# Altium schematic sheet Module01.SchDoc
size A
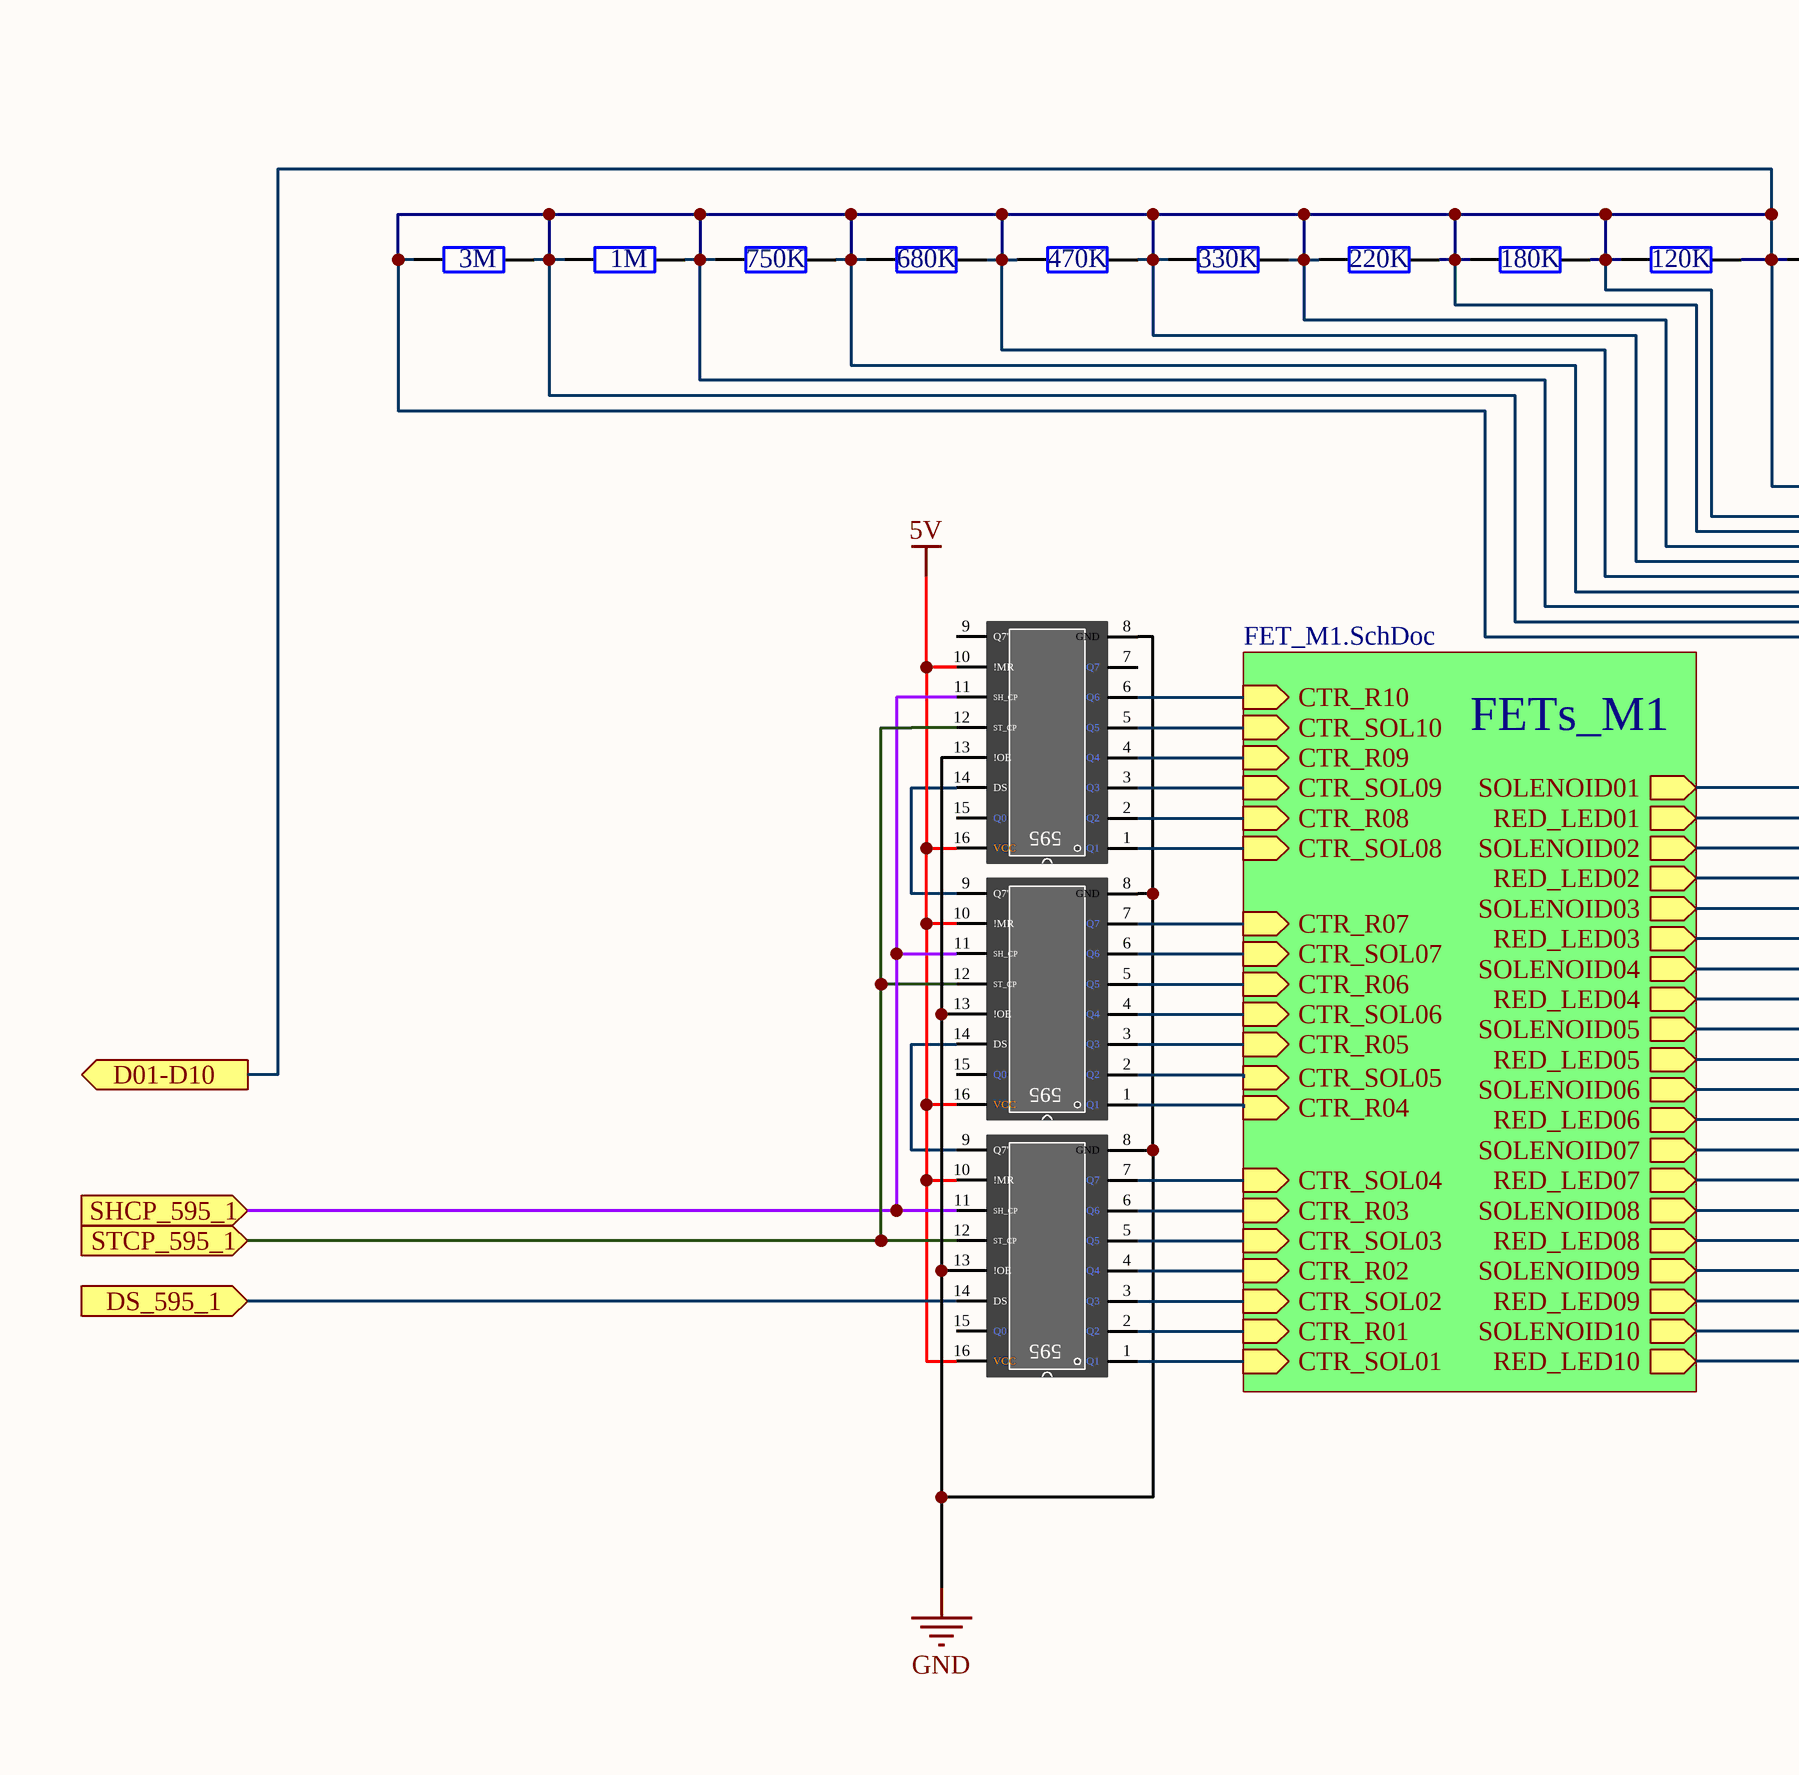
[diagram p0: Module01.SchDoc, left]
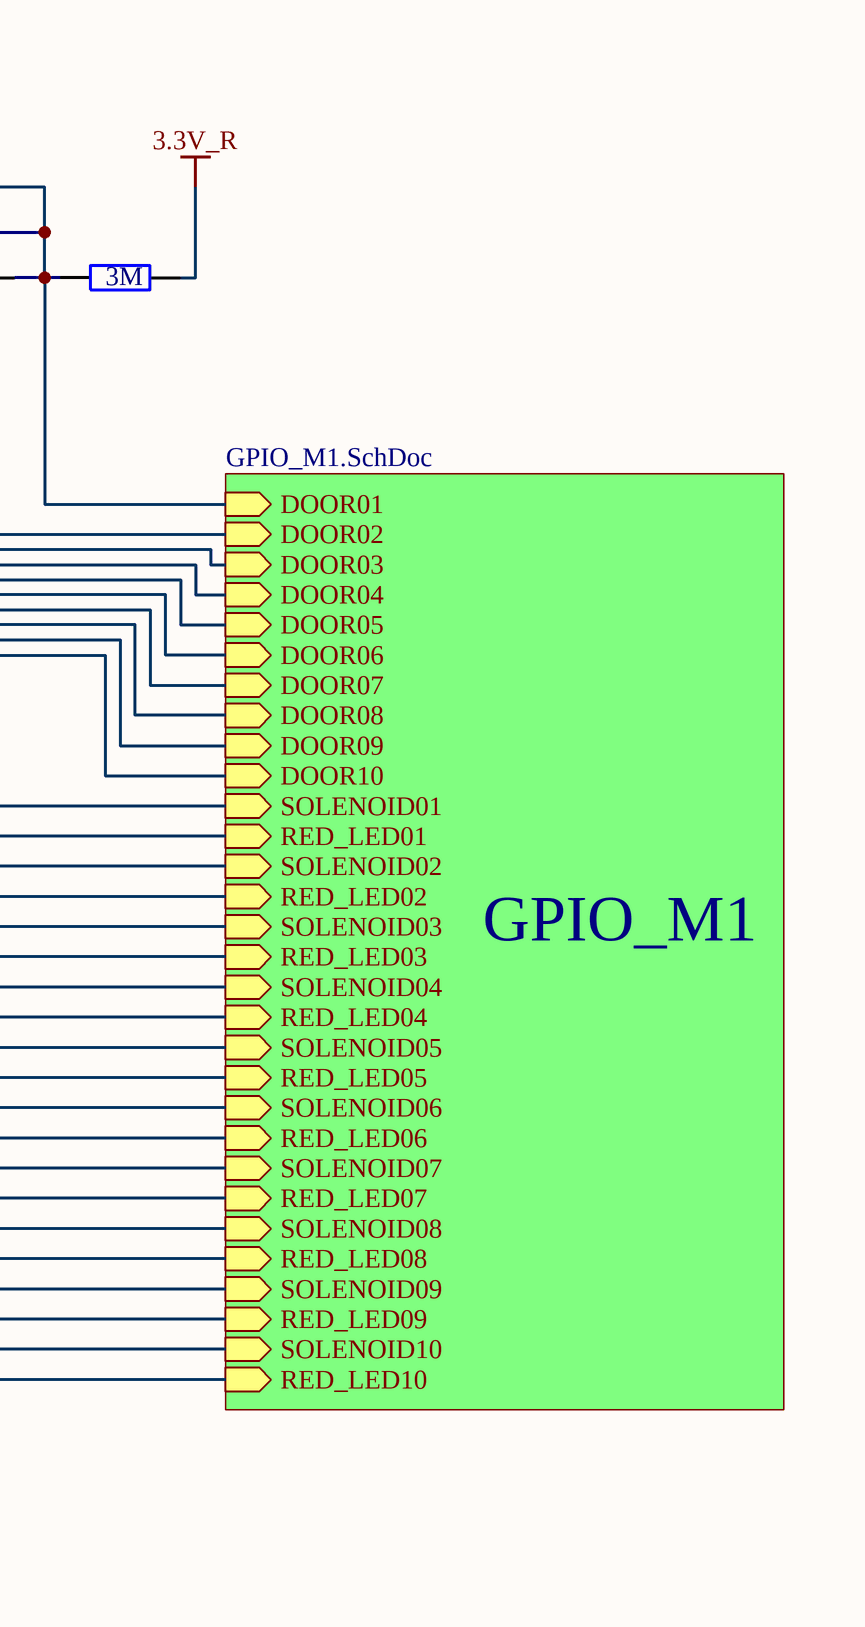
[diagram p1: Module01.SchDoc, right]

## Parts
1  5#HC74595  [5#HC74595]  (value not drawn)
2  5#HC74595  [5#HC74595]  (value not drawn)
3  5#HC74595  [5#HC74595]  (value not drawn)
R1  3M  [AXIAL-0.4]
R2  1M  [AXIAL-0.4]
R3  750K  [AXIAL-0.4]
R4  680K  [AXIAL-0.4]
R5  470K  [AXIAL-0.4]
R6  330K  [AXIAL-0.4]
R7  220K  [AXIAL-0.4]
R8  180K  [AXIAL-0.4]
R9  120K  [AXIAL-0.4]
R10  3M  [AXIAL-0.4]

## Sub-sheets
FETs_M1 = FET_M1.SchDoc: CTR_SOL01 (in), CTR_R01 (in), SOLENOID01 (out), RED_LED01 (out), CTR_SOL04 (in), CTR_R04 (in), SOLENOID04 (out), RED_LED04 (out), CTR_SOL07 (in), CTR_R07 (in), SOLENOID07 (out), RED_LED07 (out), CTR_SOL09 (in), CTR_R09 (in), SOLENOID09 (out), RED_LED09 (out), CTR_SOL02 (in), CTR_R02 (in), SOLENOID02 (out), RED_LED02 (out), CTR_SOL05 (in), CTR_R05 (in), SOLENOID05 (out), RED_LED05 (out), CTR_SOL08 (in), CTR_R08 (in), SOLENOID08 (out), RED_LED08 (out), CTR_SOL10 (in), CTR_R10 (in), SOLENOID10 (out), RED_LED10 (out), CTR_SOL03 (in), CTR_R03 (in), SOLENOID03 (out), RED_LED03 (out), CTR_SOL06 (in), CTR_R06 (in), SOLENOID06 (out), RED_LED06 (out)
GPIO_M1 = GPIO_M1.SchDoc: DOOR01 (in), DOOR02 (in), DOOR03 (in), DOOR04 (in), DOOR05 (in), SOLENOID01 (in), RED_LED01 (in), SOLENOID02 (in), RED_LED02 (in), SOLENOID03 (in), RED_LED03 (in), SOLENOID04 (in), RED_LED04 (in), SOLENOID05 (in), RED_LED05 (in), DOOR06 (in), DOOR07 (in), DOOR08 (in), DOOR09 (in), DOOR10 (in), SOLENOID06 (in), RED_LED06 (in), SOLENOID07 (in), RED_LED07 (in), SOLENOID08 (in), RED_LED08 (in), SOLENOID09 (in), RED_LED09 (in), SOLENOID10 (in), RED_LED10 (in)

## Ports
D01-D10 (out), DS_595_1 (in), SHCP_595_1 (in), STCP_595_1 (in)

## Nets
3.3V_R: R10.1
5V: 1.10(!MR) 1.16(VCC) 2.10(!MR) 2.16(VCC) 3.10(!MR) 3.16(VCC)
GND: 1.8(GND) 1.13(!OE) 2.8(GND) 2.13(!OE) 3.8(GND) 3.13(!OE)
D01-D10: R1.1 R1.2 R2.1 R2.2 R3.1 R3.2 R4.1 R4.2 R5.1 R5.2 R6.1 R6.2 R7.1 R7.2 R8.1 R8.2 R9.1 R9.2 R10.2 ; port D01-D10, sheet GPIO_M1/DOOR01, sheet GPIO_M1/DOOR02, sheet GPIO_M1/DOOR03, sheet GPIO_M1/DOOR04, sheet GPIO_M1/DOOR05, sheet GPIO_M1/DOOR06, sheet GPIO_M1/DOOR07, sheet GPIO_M1/DOOR08, sheet GPIO_M1/DOOR09, sheet GPIO_M1/DOOR10
DS_595_1: 1.14(DS) ; port DS_595_1
SHCP_595_1: 1.11(SH_CP) 2.11(SH_CP) 3.11(SH_CP) ; port SHCP_595_1
STCP_595_1: 1.12(ST_CP) 2.12(ST_CP) 3.12(ST_CP) ; port STCP_595_1
Net1_1: 1.1(Q1) ; sheet FETs_M1/CTR_SOL01
Net1_2: 1.2(Q2) ; sheet FETs_M1/CTR_R01
Net1_3: 1.3(Q3) ; sheet FETs_M1/CTR_SOL02
Net1_4: 1.4(Q4) ; sheet FETs_M1/CTR_R02
Net1_5: 1.5(Q5) ; sheet FETs_M1/CTR_SOL03
Net1_6: 1.6(Q6) ; sheet FETs_M1/CTR_R03
Net1_7: 1.7(Q7) ; sheet FETs_M1/CTR_SOL04
Net1_9: 1.9(Q7') 2.14(DS)
Net2_1: 2.1(Q1) ; sheet FETs_M1/CTR_R04
Net2_2: 2.2(Q2) ; sheet FETs_M1/CTR_SOL05
Net2_3: 2.3(Q3) ; sheet FETs_M1/CTR_R05
Net2_4: 2.4(Q4) ; sheet FETs_M1/CTR_SOL06
Net2_5: 2.5(Q5) ; sheet FETs_M1/CTR_R06
Net2_6: 2.6(Q6) ; sheet FETs_M1/CTR_SOL07
Net2_7: 2.7(Q7) ; sheet FETs_M1/CTR_R07
Net2_9: 2.9(Q7') 3.14(DS)
Net3_1: 3.1(Q1) ; sheet FETs_M1/CTR_SOL08
Net3_2: 3.2(Q2) ; sheet FETs_M1/CTR_R08
Net3_3: 3.3(Q3) ; sheet FETs_M1/CTR_SOL09
Net3_4: 3.4(Q4) ; sheet FETs_M1/CTR_R09
Net3_5: 3.5(Q5) ; sheet FETs_M1/CTR_SOL10
Net3_6: 3.6(Q6) ; sheet FETs_M1/CTR_R10
(unnamed): sheet FETs_M1/SOLENOID01, sheet GPIO_M1/SOLENOID01
(unnamed): sheet FETs_M1/RED_LED01, sheet GPIO_M1/RED_LED01
(unnamed): sheet FETs_M1/SOLENOID04, sheet GPIO_M1/SOLENOID04
(unnamed): sheet FETs_M1/RED_LED04, sheet GPIO_M1/RED_LED04
(unnamed): sheet FETs_M1/SOLENOID07, sheet GPIO_M1/SOLENOID07
(unnamed): sheet FETs_M1/RED_LED07, sheet GPIO_M1/RED_LED07
(unnamed): sheet FETs_M1/SOLENOID09, sheet GPIO_M1/SOLENOID09
(unnamed): sheet FETs_M1/RED_LED09, sheet GPIO_M1/RED_LED09
(unnamed): sheet FETs_M1/SOLENOID02, sheet GPIO_M1/SOLENOID02
(unnamed): sheet FETs_M1/RED_LED02, sheet GPIO_M1/RED_LED02
(unnamed): sheet FETs_M1/SOLENOID05, sheet GPIO_M1/SOLENOID05
(unnamed): sheet FETs_M1/RED_LED05, sheet GPIO_M1/RED_LED05
(unnamed): sheet FETs_M1/SOLENOID08, sheet GPIO_M1/SOLENOID08
(unnamed): sheet FETs_M1/RED_LED08, sheet GPIO_M1/RED_LED08
(unnamed): sheet FETs_M1/SOLENOID10, sheet GPIO_M1/SOLENOID10
(unnamed): sheet FETs_M1/RED_LED10, sheet GPIO_M1/RED_LED10
(unnamed): sheet FETs_M1/SOLENOID03, sheet GPIO_M1/SOLENOID03
(unnamed): sheet FETs_M1/RED_LED03, sheet GPIO_M1/RED_LED03
(unnamed): sheet FETs_M1/SOLENOID06, sheet GPIO_M1/SOLENOID06
(unnamed): sheet FETs_M1/RED_LED06, sheet GPIO_M1/RED_LED06

Not connected (* = marked no-connect by the designer): 1 15(Q0); 2 15(Q0); 3 7(Q7) 9(Q7') 15(Q0)

## Notes on the sheet
- (in symbol 5#HC74595) 595

## Library data of the parts
R1-R10 = Res2: Resistor; Published: 8-Jun-2000; LatestRevisionDate: 17-Jul-2002; LatestRevisionNote: Re-released for DXP Platform.; PackageReference: AXIAL-0.4; Publisher: Altium Limited; PackageDescription: Axial Device, Thru-Hole; 2 Leads; 0.4 in Pin Spacing